# Altium project JacdacModuleTesterEc30 91.PrjPCB
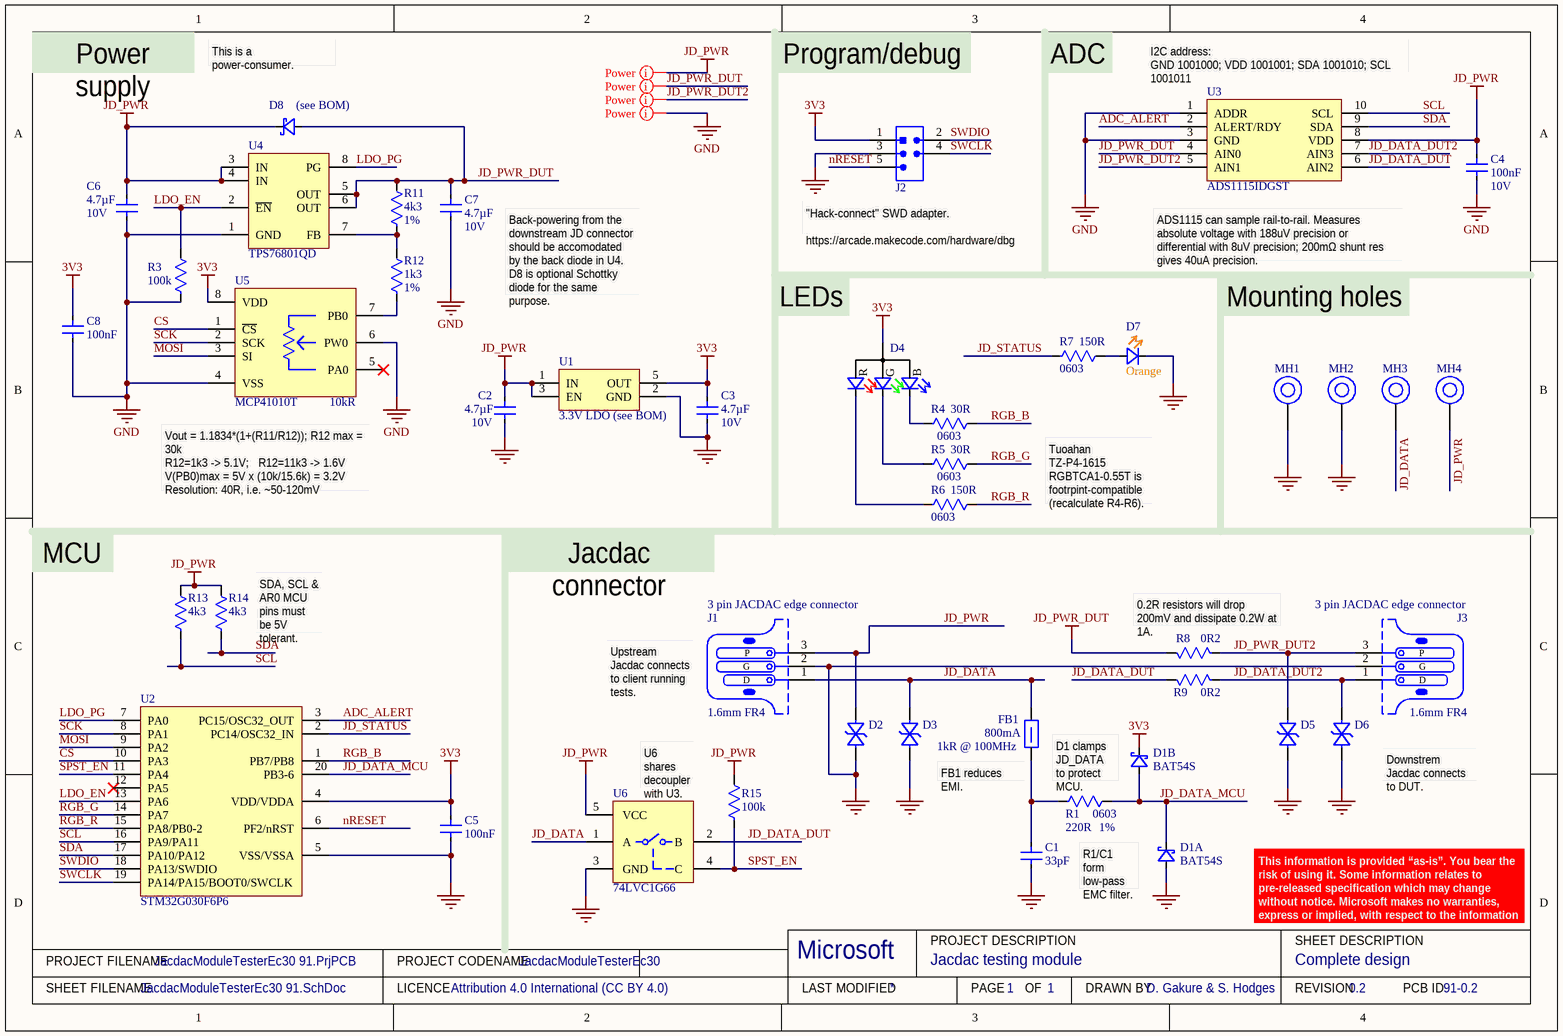
[diagram p0: JacdacModuleTesterEc30 91.SchDoc]
ProjectRevision: 0.2; ProjectLicenceTerms: Attribution 4.0 International (CC BY 4.0); ProjectDrawnBy: D. Gakure & S. Hodges; ProjectCodenameID: 91; ProjectCodenameDescription: Jacdac testing module; ProjectCodeName: JacdacModuleTesterEc30
1 sheet, 43 parts. Net scope: global (net labels, ports and power ports of the same name join across sheets).
Board file: JacdacModuleTesterEc30 91.PcbDoc

## Sheet JacdacModuleTesterEc30 91.SchDoc: Complete design
size A4; DrawnBy: D. Gakure & S. Hodges; DocumentNumber: 1; Revision: 0.2; SheetNumber: 1; SheetTotal: 1; VersionControl_RevNumber: 1

### Parts
C1  33pF  [CAP0603]
C2  Capacitance: 4.7µF  Voltage Rating: 10V  [CAP 0603 (1608) x 1.2mm]  (hidden comment: CL10A475KP8NNNC)
C3  Capacitance: 4.7µF  Voltage Rating: 10V  [CAP 0603 (1608) x 1.2mm]  (hidden comment: CL10A475KP8NNNC)
C4  Rated Voltage: 10V  [CAP0603]  (hidden comment: 100nF)
C5  100nF  [CAP0603]
C6  Capacitance: 4.7µF  Voltage Rating: 10V  [CAP 0603 (1608) x 1.2mm]  (hidden comment: CL10A475KP8NNNC)
C7  Capacitance: 4.7µF  Voltage Rating: 10V  [CAP 0603 (1608) x 1.2mm]  (hidden comment: CL10A475KP8NNNC)
C8  100nF  [CAP0603]
D1  BAT54S  [NXP-BAT54S-TO-236AB - without outline]  (parts A,B of 2)
D2  RCLAMP0521P-N  [TVS 0402 - L]  (value not drawn)
D3  RCLAMP0521P-N  [TVS 0402 - L]  (value not drawn)
D4  HSMF-C114  [HSMF-C114]  (value not drawn)
D5  RCLAMP0521P-N  [TVS 0402 - L]  (value not drawn)
D6  RCLAMP0521P-N  [TVS 0402 - L]  (value not drawn)
D7  Colour: Orange  [0603 Orange]  (hidden comment: 19-217/S2C-AQ1R1B/3T)
D8  Generic Part Number: (see BOM)  [MBR120VLSFT3G]  (hidden comment: MBR120VLSFT3G)
FB1  Current Rating: 800mA  Impedance: 1kR @ 100MHz  [TDK MPZ1608 0.8mm - without outline]  (hidden comment: TDK MPZ1608S102ATA00)
J1  3 pin JACDAC edge connector  PCB Type: 1.6mm FR4  [JACDAC_EDGE_CONNECTOR_NO_TRACES_CABLE_GUIDE]  (no BOM)
J2  Hack Connect Mini 1.27 mm pitch 2-row  [HACK_CONNECT_MINI_5_X_1_27]  (value not drawn)  (no BOM)
J3  3 pin JACDAC edge connector  PCB Type: 1.6mm FR4  [JACDAC_EDGE_CONNECTOR_NO_TRACES_CABLE_GUIDE]  (no BOM)
MH1  MH_7.0MMK_4.4MMC_3.1MMD_PTH  [MH_7.0MMK_4.4MMC_3.1MMD_PTH]  (value not drawn)  (no BOM)
MH2  MH_7.0MMK_4.4MMC_3.1MMD_PTH  [MH_7.0MMK_4.4MMC_3.1MMD_PTH]  (value not drawn)  (no BOM)
MH3  MH_7.0MMK_4.4MMC_3.1MMD_PTH  [MH_7.0MMK_4.4MMC_3.1MMD_PTH]  (value not drawn)  (no BOM)
MH4  MH_7.0MMK_4.4MMC_3.1MMD_PTH  [MH_7.0MMK_4.4MMC_3.1MMD_PTH]  (value not drawn)  (no BOM)
R1  Resistance Tolerance: 1%  Case/Package: 0603  [RC0603]  (hidden comment: 220R)
R3  100k  [RES0603]
R4  Case/Package: 0603  [RC0603]  (hidden comment: 30R)
R5  Case/Package: 0603  [RC0603]  (hidden comment: 30R)
R6  Case/Package: 0603  [RC0603]  (hidden comment: 150R)
R7  Case/Package: 0603  [RC0603]  (hidden comment: 150R)
R8  value 0R2  [RES1206]  (hidden comment: KDV12FR200ET)
R9  value 0R2  [RES1206]  (hidden comment: KDV12FR200ET)
R11  Tolerance: 1%  [RES0603]  (hidden comment: 4k3)
R12  Tolerance: 1%  [RES0603]  (hidden comment: 1k3)
R13  4k3  [RES0603]
R14  4k3  [RES0603]
R15  100k  [RES0603]
U1  Manufacturer Part Number 1: 3.3V LDO (see BOM)  [MICRONE-SOT23-5]
U2  STM32G030F6P6  [20-TSSOP]
U3  ADS1115IDGST  [ADS1115IDGST]
U4  TPS76801QD  [SOIC8]
U5  MCP41010T  Resistance: 10kR  [MICROCHIP-SOIC8]
U6  74LVC1G66  [TI-SOT23-5]

### Nets
3V3: C3.2 C5.2 C8.2 D1.2(K) D4.1(A) J2.1(VCC) U1.5(OUT) U2.4(VDD/VDDA) U5.8(VDD)
GND: C1.1 C2.1 C3.1 C4.1 C5.1 C6.1 C7.1 C8.1 D1.1(A) D2.2(A) D3.2(A) D5.2(A) D6.2(A) D7.1(K) J1.2(G) J2.3(GND) J3.2(G) MH1.1 MH2.1 R3.2 U1.2(GND) U2.5(VSS/VSSA) U3.1(ADDR) U3.3(GND) U4.1(GND) U5.4(VSS) U5.6(PW0) U6.3(GND)
JD_PWR: C2.2 C4.2 C6.2 D2.1(K) D8.1(K) J1.3(P) MH4.1 R13.1 R14.1 R15.1 U1.1(IN) U1.3(EN) U3.8(VDD) U4.3(IN) U4.4(IN) U6.5(VCC)
JD_PWR_DUT: C7.2 D8.2(A) R8.1 R11.1 U3.4(AIN0) U4.5(OUT) U4.6(OUT)
ADC_ALERT: U2.3(PC15/OSC32_OUT) U3.2(ALERT/RDY)
CS: U2.10(PA3) U5.1(~{CS})
JD_DATA: D3.1(K) FB1.1 J1.1(D) MH3.1 U6.1(A)
JD_DATA_DUT: R9.1 U3.6(AIN2) U6.2(B)
JD_DATA_DUT2: D6.1(K) J3.1(D) R9.2 U3.7(AIN3)
JD_DATA_MCU: D1.3(K) R1.2 U2.20(PB3-6)
JD_PWR_DUT2: D5.1(K) J3.3(P) R8.2 U3.5(AIN1)
JD_STATUS: R7.1 U2.2(PC14/OSC32_IN)
LDO_EN: R3.1 U2.13(PA6) U4.2(~{EN})
LDO_PG: U2.7(PA0) U4.8(PG)
MOSI: U2.9(PA2) U5.3(SI)
nRESET: J2.5(RESET) U2.6(PF2/nRST)
RGB_B: R4.2 U2.1(PB7/PB8)
RGB_G: R5.2 U2.14(PA7)
RGB_R: R6.2 U2.15(PA8/PB0-2)
SCK: U2.8(PA1) U5.2(SCK)
SCL: R13.2 U2.16(PA9/PA11) U3.10(SCL)
SDA: R14.2 U2.17(PA10/PA12) U3.9(SDA)
SPST_EN: R15.2 U2.11(PA4) U6.4(C)
SWCLK: J2.4(SWCLK) U2.19(PA14/PA15/BOOT0/SWCLK)
SWDIO: J2.2(SWDIO) U2.18(PA13/SWDIO)
NetC1_2: C1.2 FB1.2 R1.1
NetD4_2: D4.2(R) R6.1
NetD4_3: D4.3(G) R5.1
NetD4_4: D4.4(B) R4.1
NetD7_2: D7.2(A) R7.2
NetR11_2: R11.2 R12.1 U4.7(FB)
NetR12_2: R12.2 U5.7(PB0)

Not connected (* = marked no-connect by the designer): U2 12(PA5)*; U5 5(PA0)*

### Layout directives
net class Power: GND, JD_PWR, JD_PWR_DUT, JD_PWR_DUT2

### Notes on the sheet
- Power supply
- This is a power-consumer.
- Program/debug
- ADC
- (near U3) I2C address:
  GND 1001000; VDD 1001001; SDA 1001010; SCL 1001011
- (near J2) "Hack-connect" SWD adapter.
  https://arcade.makecode.com/hardware/dbg
- Back-powering from the downstream JD connector should be accomodated by the back diode in U4. D8 is optional Schottky diode for the same purpose.
- (near D4) LEDs
- (near U3) ADS1115 can sample rail-to-rail. Measures absolute voltage with 188uV precision or differential with 8uV precision; 200mΩ shunt res gives 40uA precision.
- Mounting holes
- (near U5) Vout = 1.1834*(1+(R11/R12)); R12 max = 30k
  R12=1k3 -> 5.1V;   R12=11k3 -> 1.6V
  V(PB0)max = 5V x (10k/15.6k) = 3.2V
  Resolution: 40R, i.e. ~50-120mV
- Tuoahan TZ-P4-1615
  RGBTCA1-0.55T is footrpint-compatible (recalculate R4-R6).
- MCU
- Jacdac connector
- (near R14) SDA, SCL & AR0 MCU pins must be 5V tolerant.
- (near R8) 0.2R resistors will drop 200mV and dissipate 0.2W at 1A.
- Upstream Jacdac connects to client running tests.
- U6 shares decoupler with U3.
- (near FB1) FB1 reduces EMI.
- D1 clamps JD_DATA to protect MCU.
- (near D6) Downstrem Jacdac connects to DUT.
- R1/C1 form low-pass EMC filter.
- This information is provided “as-is”. You bear the risk of using it. Some information relates to pre-released specification which may change without notice. Microsoft makes no warranties, express or implied, with respect to the information provided here.
- PROJECT FILENAME
- PROJECT CODENAME
- Microsoft
- PROJECT DESCRIPTION
- SHEET DESCRIPTION
- SHEET FILENAME
- LICENCE
- LAST MODIFIED
- PAGE
- OF
- DRAWN BY
- REVISION
- PCB ID

### Library data of the parts
C1 = CAP0603_GENERIC: Generic 0603 capacitor 33pF; Rated Voltage: 10V; Package Size: 0603; Value: 33pF; Manufacturer: Generic; Manufacturer 1: Generic
C2 C3 C6 C7 = 4.7uF 10V X5R ±10% Samsung CL: Generic 0603 capacitor 4.7uF 10V, e.g. Samsung CL10A475KP8NNNC; Dielectric: X5R; Tolerance: 10%; Created By: shodges; Supplier 1: Digi-Key; Manufacturer: Samsung; Manufacturer Part Number: CL10A475KP8NNNC; Stock 1: 40000; Pricing 1: 1=0.15, 10=0.109, 100=0.0513, 500=0.036, 1000=0.0298 (USD); Mount: Surface Mount; Case Code (Imperial): 0603; Contact Plating: Tin; Min Operating Temperature: -55°C; Max Operating Temperature: 85°C; Package Quantity: 1; Packaging: Tape and Reel; Length: 1.6mm; Height: 0.8mm; Width: 0.031inch; Thickness: 0.035inch; Depth: 0.8mm; Radiation Hardening: No; Supplier Part Number 1: 1276-1044-1-ND; Supplier 2: Farnell; Supplier Part Number 2: 3010071; Case Code (Metric): 1608; Case/Package: 0603
C4 = CAP0603_GENERIC: Generic 0603 capacitor 100nF; Package Size: 0603; Value: 100nF; Manufacturer: Generic; Manufacturer 1: Generic
C5 C8 = CAP0603_GENERIC: Generic 0603 capacitor 100nF; Rated Voltage: 10V; Package Size: 0603; Value: 100nF; Manufacturer: Generic; Manufacturer 1: Generic
D1 = BAT54S: DIODE ARRAY SCHOTTKY 30V SOT23; Manufacturer: Nexperia; Manufacturer Part Number: BAT54S,235; Supplier 1: Digi-Key; RoHS: No; Category: Rectifier Diodes; Stock 1: 14011; Pricing 1: 1=0.13000, 10=0.11900, 100=0.05610, 500=0.03326, 1000=0.02185, 5000=0.02138 (USD); ComponentLink1URL: https://assets.nexperia.com/documents/data-sheet/BAT54_SER.pdf; ComponentLink1Description: NXP datasheet online; Supplier 2: Mouser; Supplier 3: RSComponents; Supplier Part Number 2: 771-BAT54S235; Supplier Part Number 3: 1707990; Supplier Part Number 1: 1727-1868-1-ND; Generic Part Number: BAT54S
D2 D3 D5 D6 = RCLAMP0521P-N: Bidirectional 5V (Max) 6V 16V 3.5A (8/20us) 0402 TVS RoHS; Manufacturer: Born Semiconductor; Package: 0402; Created By: D Gakure; Checked By: ?; Supplier1: LCSC; Supplier1 Part Number: C316043; ComponentLink1Description: Online datasheet; ComponentLink1URL: https://datasheet.lcsc.com/szlcsc/Bourne-Semicon-Shenzhen-RCLAMP0521P-N_C316043.pdf; Manufacturer Part Number: RCLAMP0521P-N
D4 = HSMF-C114: RGB LED 0606 (1616 Metric); 626nm R, 525nm G, 470nm B; 1.9V R, 3.4V G, 3.4V B; Manufacturer: Broadcom Avago; Color: Blue,Green,Red; Lens Color: White; Viewing Angle: 145°; Luminous Intensity: 70mcd; Lens Style: Diffused,Rectangular; Forward Current: 20mA; Lens Transparency: Diffused; Number of Elements: 3; Reverse Voltage: 5V; Power Rating: 78mW; Supplier 1: Digi-Key; Manufacturer Part Number: HSMF-C114; RoHS: Yes; Category: Optoelectronics; Stock 1: 20555; Pricing 1: 1=1.78000, 10=1.12500, 100=0.83250, 500=0.76500, 1000=0.63000, 2000=0.59850 (USD); Mount: Surface Mount; Case/Package: 0606; Number of Pins: 4; Case Code (Metric): 1616; Case Code (Imperial): 0606; Min Operating Temperature: -40°C; Max Operating Temperature: 85°C; Forward Voltage: 3.4V; Packaging: Tape and Reel; Wavelength: 470nm; Package Quantity: 4000; Dominant Wavelength: 470nm; Test Current: 20mA; Number of LEDs: 3; Length: 1.6mm; Width: 1.5mm; Height: 0.35mm; Depth: 1.6mm; Radiation Hardening: No; REACH SVHC: No SVHC; Lead Free: Lead Free; Supplier 2: Farnell; Stock 2: 8134; Pricing 2: 1=1.56000, 10=0.97100, 25=0.87800, 50=0.78500, 100=0.69200, 500=0.60500 (GBP); Supplier 3: Mouser; Stock 3: 14991; Pricing 3: 1=1.69000, 10=1.13000, 50=1.13000, 100=0.85600, 1000=0.74800, 10000=0.74800 (USD); Supplier Part Number 1: 516-1795-1-ND; Supplier Part Number 3: 630-HSMF-C114; Supplier Part Number 2: 1058362; ComponentLink1Description: Online datasheet; ComponentLink1URL: https://docs.broadcom.com/docs/AV02-2451EN; Created By: D. Gakure; Checked By: ?; Supplier Part Number 10: ?
D7 = 19-217/S2C-AQ1R1B/3T: LED ORANGE DIFFUSED 0603 SMD; Manufacturer: Everlight Elec; Manufacturer Part Number: 19-217/S2C-AQ1R1B/3T; Mount: Surface Mount; Case/Package: 0603; Color: Orange; Case Code (Imperial): 0603; ComponentLink1URL: https://datasheet.lcsc.com/lcsc/1912171731_Everlight-Elec-19-217-S2C-AQ1R1B-3T_C146215.pdf; ComponentLink1Description: Online datasheet; Supplier 1: LCSC; Supplier 1 Part Number: C146215
D8 = MBR120VLSFT3G: DIODE SCHOTTKY 20V 1A SOD123FL; Manufacturer: ON Semiconductor; Max Surge Current: 45A; Forward Voltage: 340mV; Peak Reverse Current: 600uA; Element Configuration: Single; Polarity: Standard; Supplier 1: Digi-Key; RoHS: Yes; Category: Schottky Diodes; Stock 1: 32481; Pricing 1: 1=0.39000, 10=0.28600, 100=0.19920, 500=0.12616, 1000=0.10292, 2000=0.09960, 5000=0.09628 (USD); Number of Pins: 2; Min Operating Temperature: -65°C; Max Operating Temperature: 125°C; Package Quantity: 10000; Forward Current: 1A; Packaging: Tape and Reel; Max Reverse Leakage Current: 600uA; Average Rectified Current: 1A; Peak Non-Repetitive Surge Current: 45A; Max Repetitive Reverse Voltage (Vrrm): 20V; Max Forward Surge Current (Ifsm): 45A; Voltage Rating (DC): 20V; Current Rating: 1A; Output Current: 1A; Max Reverse Voltage (DC): 20V; Radiation Hardening: No; REACH SVHC: No SVHC; Lead Free: Lead Free; Halogen Free: Halogen Free; ComponentLink4URL: https://datasheet.ciiva.com/6380/mbr120vlsft1-d-6380910.pdf; ComponentLink4Description: On Semi datasheet online; Supplier 2: Mouser; Supplier 3: RSComponents; Supplier Part Number 3: 1867479; Supplier Part Number 2: 863-MBR120VLSFT3G; Supplier Part Number 1: MBR120VLSFT3GOSCT-ND; Manufacturer Part Number: MBR120VLSFT3G
FB1 = TDK MPZ1608S102ATA00: 0603 1k@100MHz 0.8A chip; Core Material: Ferrite; Tolerance: 25%; DC Resistance (DCR): 300mR; Supplier 1: Digi-Key; Stock 1: 113542; Pricing 1: 1=0.1, 10=0.079, 25=0.0716, 50=0.0644, 100=0.0472, 250=0.03432, 500=0.03146, 1000=0.02717 (USD); Mount: Surface Mount; Case/Package: 0603; Case Code (Metric): 1608; Case Code (Imperial): 0603; Package Quantity: 4000; Packaging: Tape and Reel; Max DC Current: 800mA; Length: 0.063inch; Height: 0.037inch; Width: 0.031inch; ComponentLink2URL: https://www.mouser.co.uk/datasheet/2/400/eads_commercial_power_mpz1608_en-923650.pdf; ComponentLink2Description: datasheet online; Supplier 2: Mouser; ComponentLink3Description: datasheet; ComponentLink3URL: Y:\System\Altium\Libraries 2014\TDK\Datasheets\eads_commercial_power_mpz1608_en-923650.pdf; Supplier Part Number 1: 445-8694-1-ND; Supplier Part Number 2: 810-MPZ1608S102ATA00; Manufacturer: TDK; Manufacturer Part Number: MPZ1608S102ATA00
J1 J3 = Jacdac edge connector: 3 pin Jacdac edge connector 1.27mm pitch; Manufacturer Part Number: JACDAC_EDGE_CONNECTOR; Checked By: ?; Created By: D. Gakure; ComponentLink1Description: Yuliang JACDAC cable connector drawing online; ComponentLink1URL: https://github.com/microsoft/jacdac-mdk/blob/main/connector/JACDAC-Connector-by-Yuliang-2020-11-28.pdf; ComponentLink2Description: JACDAC PCB edge connector spec onlin; ComponentLink2URL: https://github.com/microsoft/jacdac-mdk/blob/main/connector/JACDAC_PCB_Edge_Connector_Drawing_JD-PEC-01_rev_01.pdf
J2 = HACK_CONNECT_MINI
MH1-MH4 = MH_7.0MMK_4.4MMC_3.1MMD_PTH: Mounting Hole 7.0mm keepout, 4.4mm annualar ring and 3.1mm Drill PTH
R1 = RC0603FR-07220RL: Res Thick Film 0603 220 Ohm 1% 0.1W ±100ppm/°C SMD; Manufacturer 1: Yageo; Max Power Dissipation: 100mW; Voltage Rating: 50V; ComponentLink1URL: https://datasheet.ciiva.com/11819/0900766b80f96399-11819290.pdf; ComponentLink1Description: Online datasheet; Supplier 1: Digi-Key; Manufacturer Part Number 1: RC0603FR-07220RL; RoHS: Yes; Category: Chip SMD Resistors; Stock 1: 242327; Pricing 1: 1=0.10000, 10=0.02400, 100=0.00970, 1000=0.00436, 2500=0.00378 (USD); Number of Pins: 2; Case Code (Imperial): 0603; Case Code (Metric): 1608; Size Code: 0603; Min Operating Temperature: -55°C; Max Operating Temperature: 155°C; Packaging: Tape and Reel; Tolerance: 1%; Resistor Type: Thick Film; Number of Terminations: 2; Temperature Coefficient: 100ppm/°C; Series: RC; Power Rating: 100mW; Package Quantity: 1; Features: Moisture Resistant; Voltage Rating (DC): 50V; Termination: SMD/SMT; Construction: Rectangular; Length: 1.6mm; Width: 0.031inch; Height: 0.022inch; Depth: 0.8mm; RoHS Compliant: Yes; REACH SVHC: No SVHC; Military Standard: Not; Lead Free: Lead Free; Supplier 2: Farnell; Supplier 3: RSComponents; Supplier 4: Mouser; Supplier Part Number 1: 311-220HRCT-ND; Supplier Part Number 3: 1995497; Supplier Part Number 2: 9238409; Supplier Part Number 4: 603-RC0603FR-07220RL; Supplier 5: LCSC; Supplier Part Number 5: C107696; Resistance: 220R; Manufacturer: Yageo; Manufacturer Part Number: RC0603FR-07220RL
R3 R15 = RES0603_GENERIC: Generic 0603 chip resistor 100k; Power: *mW; Tolerance: 5%; Value: 100k; Manufacturer: Generic; Package Size: 0603; Manufacturer 1: Generic
R4 R5 = RC0603FR-0730RL: Res Thick Film 0603 30 Ohm 1% 0.1W ±100ppm/°C SMD; Manufacturer 1: Yageo; Voltage Rating (DC): 50V; Power Rating: 100mW; ComponentLink1URL: https://datasheet.ciiva.com/11819/0900766b80f96399-11819290.pdf; ComponentLink1Description: Online datasheet; Supplier 1: Digi-Key; Manufacturer Part Number 1: RC0603FR-0730RL; RoHS: Yes; Category: Chip SMD Resistors; Stock 1: 181493; Pricing 1: 1=0.10000, 10=0.02400, 100=0.00970, 1000=0.00436, 2500=0.00378 (USD); Mount: Surface Mount; Case Code (Imperial): 0603; Size Code: 0603; Min Operating Temperature: -55°C; Max Operating Temperature: 155°C; Resistor Type: Thick Film; Temperature Coefficient: 100ppm/°C; Packaging: Tape and Reel; Package Quantity: 1; Voltage Rating: 50V; Number of Terminations: 2; Termination: SMD/SMT; Max Power Dissipation: 100mW; Features: Moisture Resistant; Series: RC; Construction: Rectangular; Technology: THICK FILM; Length: 0.063inch; Width: 0.031inch; Height: 0.022inch; Depth: 0.8mm; Lead Free: Lead Free; Military Standard: Not; RoHS Compliant: Yes; Supplier 2: Farnell; Supplier 3: Mouser; Case Code (Metric): 1608; Supplier Part Number 1: 311-30.0HRCT-ND; Supplier Part Number 2: 3495813; Supplier Part Number 3: 603-RC0603FR-0730RL; Supplier 5: LCSC; Supplier Part Number 5: C128060; Tolerance: 1%; Resistance: 30R; Manufacturer: Yageo; Manufacturer Part Number: RC0603FR-0730RL
  R4: ComponentLink2URL: https://datasheet.ciiva.com/11819/0900766b80c66297-11819676.pdf?src-supplier=RSComponents; ComponentLink2Description: https://datasheet.ciiva.com/11819/0900766b80c66297-11819676.pdf?src-supplier=RSComponents; ComponentLink3URL: https://datasheet.ciiva.com/2455/pyu-r-int-thick-7-2455119.pdf?src-supplier=Digi-Key; ComponentLink3Description: https://datasheet.ciiva.com/2455/pyu-r-int-thick-7-2455119.pdf?src-supplier=Digi-Key; ComponentLink4URL: https://datasheet.ciiva.com/2455/pyu-r-int-thick-7-2455120.pdf?src-supplier=Digi-Key; ComponentLink4Description: https://datasheet.ciiva.com/2455/pyu-r-int-thick-7-2455120.pdf?src-supplier=Digi-Key; ComponentLink5URL: https://datasheet.ciiva.com/2455/pyu-r-int-thick-7-2455121.pdf?src-supplier=Digi-Key; ComponentLink5Description: https://datasheet.ciiva.com/2455/pyu-r-int-thick-7-2455121.pdf?src-supplier=Digi-Key
R6 R7 = RC0603FR-07150RL: Res Thick Film 0603 150 Ohm 1% 1/10W ±100ppm/°C SMD; Manufacturer 1: Yageo; Power Rating: 100mW; Voltage Rating (DC): 50V; ComponentLink1URL: https://datasheet.ciiva.com/11819/0900766b80f96399-11819290.pdf; ComponentLink1Description: Online datasheet; Supplier 1: Digi-Key; Manufacturer Part Number 1: RC0603FR-07150RL; RoHS: Yes; Category: Chip SMD Resistors; Stock 1: 2262542; Pricing 1: 1=0.10000, 10=0.02400, 100=0.00970, 1000=0.00436, 2500=0.00378 (USD); Number of Pins: 2; Case Code (Imperial): 0603; Case Code (Metric): 1608; Size Code: 0603; Min Operating Temperature: -55°C; Max Operating Temperature: 155°C; Tolerance: 1%; Packaging: Tape and Reel; Temperature Coefficient: 100ppm/°C; Voltage Rating: 50V; Package Quantity: 5000; Termination: SMD/SMT; Resistor Type: Thick Film; Features: Moisture Resistant; Series: RC; Max Power Dissipation: 100mW; Number of Terminations: 2; Construction: Rectangular; Length: 1.6mm; Width: 0.8mm; Height: 0.45mm; Depth: 0.8mm; REACH SVHC: No SVHC; Lead Free: Lead Free; Military Standard: Not; RoHS Compliant: Yes; Supplier 2: Farnell; Supplier 3: RSComponents; Supplier 4: Mouser; Supplier Part Number 1: 311-150HRCT-ND; Supplier Part Number 2: 9238387; Supplier Part Number 3: 1995464; Supplier Part Number 4: 603-RC0603FR-07150RL; Supplier 5: LCSC; Supplier Part Number 5: C114608; Resistance Tolerance: 1%; Resistance: 150R
  R6: Manufacturer: Yageo; Manufacturer Part Number: RC0603FR-07150RL
R8 R9 = KDV12FR200ET: Res 200mOhm 1% 1/2W 1206; Manufacturer 1: Ohmite; Power: 500mW; ComponentLink1Description: Ohmite datasheet online; ComponentLink1URL: https://www.ohmite.com/assets/docs/res_kdv.pdf; Supplier 1: Digi-Key; Manufacturer Part Number 1: KDV12FR200ET; RoHS: Yes; Category: Chip SMD Resistors; Stock 1: 23605; Pricing 1: 1=0.31000, 10=0.26400, 25=0.19200, 50=0.13920, 100=0.10320, 250=0.07920, 500=0.06240, 1000=0.04320 (USD); Supplier 2: Farnell; Supplier 3: Mouser; Supplier Part Number 1: 273-KDV12FR200ETCT-ND; Supplier Part Number 2: 3273737; Supplier Part Number 3: 588-KDV12FR200ET; Tolerance: 1%; Package Size: 1206; Manufacturer: Ohmite; Manufacturer Part Number: KDV12FR200ET
R11 = RES0603_GENERIC: Generic 0603 chip resistor 4k3; Power: *mW; Value: 4k3; Manufacturer: Generic; Package Size: 0603; Manufacturer 1: Generic
R12 = RES0603_GENERIC: Generic 0603 chip resistor 1k3; Power: *mW; Value: 1k3; Manufacturer: Generic; Package Size: 0603; Manufacturer 1: Generic
R13 R14 = RES0603_GENERIC: Generic 0603 chip resistor 4k3; Power: *mW; Tolerance: 1%; Value: 4k3; Manufacturer: Generic; Package Size: 0603; Manufacturer 1: Generic
U1 = ME6211C33M5G-N: 3.3V LDO. Vin 6V max, Vf 260mV @ 200mA (typ); Manufacturer 1: MICRONE(Nanjing Micro One Elec); Output Current: 500mA; Output Type: Fixed; Output Configuration: Positive; Number of Regulators: 1; Max Input Voltage: 6; Dropout Voltage: 200mV; Supplier Part Number: C82942; Category: Voltage Regulators - Linear; Stock 1: 32529; Pricing 1: 1=0.33000, 10=0.24900, 25=0.21760, 100=0.12440, 250=0.11664, 500=0.09330, 1000=0.07153 (USD); Mount: Surface Mount; Case/Package: SOT-23-5; Supplier 1: LCSC; Min Output Voltage: 3.3V; ComponentLink3URL: https://datasheet.lcsc.com/lcsc/1811131510_MICRONE-Nanjing-Micro-One-Elec-ME6211C33M5G-N_C82942.pdf; ComponentLink3Description: On Semi datasheet online; Created: DG; Checked: ?; Manufacturer: MICRONE(Nanjing Micro One Elec); Manufacturer Part Number: 3.3V LDO (see BOM)
U2 = STM32G030F6P6: ARM® Cortex®-M0+ series IC 64MHz 32KB 20-TSSOP; Manufacturer 1: STMicroelectronics; ComponentLink1Description: Online datasheet; ComponentLink1URL: https://www.st.com/resource/en/datasheet/stm32g030f6.pdf; ComponentLink2Description: Online reference manual; ComponentLink2URL: https://www.st.com/resource/en/reference_manual/rm0454-stm32g0x0-advanced-armbased-32bit-mcus-stmicroelectronics.pdf; Supplier 1: Digi-Key; Manufacturer Part Number 1: STM32G030F6P6; RoHS: Yes; Category: Microcontrollers; Pricing 1: 1=1.85000, 10=1.65300, 74=1.56905, 148=1.28892, 296=1.20486, 444=1.06475, 962=0.93400 (USD); RoHS Compliant: Yes; Supplier 2: Farnell; Supplier 3: Mouser; Supplier 10: LCSC; Supplier Part Number 1: 497-STM32G030F6P6-ND; Supplier Part Number 2: 3294301; Supplier Part Number 3: 511-STM32G030F6P6; Supplier Part Number 10: C724040; Manufacturer: STMicroelectronics; Manufacturer Part Number: STM32G030F6P6
U3 = ADS1115IDGST: IC ADC 16-BIT I2C PROGBL 10-MSOP; Manufacturer: Texas Instruments (TI); Resolution: 16 Bit; Sampling Rate: 860 sps; Number of ADCs: 1; Number of Analog Inputs: 4|2; Architecture: Delta-Sigma; Digital Interface Type: Serial (2-Wire, I2C); Input Type: Voltage; Polarity of Input Voltage: Bipolar; Maximum Single Supply Voltage: 5.5 V; Typical Single Supply Voltage: 3.3 V; Voltage Supply Source: Single; Sample and Hold: No; Minimum Single Supply Voltage: 2 V; Typical Power Dissipation: 0.9 mW; Input Voltage: 4.096 V; Input Signal Type: Single-Ended|Differential; Integral Nonlinearity Error: 1 LSB; Single-Ended Input: Yes; Full Scale Error: 0.15 % of FSR; Lead Finish: Gold; Max Processing Temp: 260; Voltage Reference: Internal; Supplier 1: Digikey; Manufacturer Part Number: ADS1115IDGST; Stock 1: 6232; Pricing 1: 1=6.51, 10=5.847, 100=4.7903 (USD); Package: 10VSSOP; Category: ADC; Operating Temperature: -40 to 125 C; Mounting: Surface Mount; Digital Supply Support: No; Differential Input: Yes; Supplier Part Number 1: 296-24934-1-ND; ComponentLink1Description: online datasheet; ComponentLink1URL: http://www.ti.com/lit/ds/symlink/ads1115.pdf
U4 = TPS76801QD: 1-A, 10-V, low-dropout voltage regulator with power good & enable 8-SOIC -40 to 125; Manufacturer 1: Texas Instruments; Number of Outputs: 1; Output Voltage: 5.5V; Output Current: 1A; Dropout Voltage: 230mV; Max Input Voltage: 10V; Min Input Voltage: 2.7V; Reference Voltage: 1.1834V; Min Output Voltage: 1.2V; Quiescent Current: 80uA; Polarity: Positive; Accuracy: 2%; Output Type: Adjustable,Fixed; Input Bias Current: 85uA; Max Power Dissipation: 904.15mW; Min Current Limit: 1.2A; ComponentLink1URL: https://datasheet.lcsc.com/lcsc/1810181640_Texas-Instruments-TPS76801QDR_C20030.pdf; ComponentLink1Description: TI datasheet online; Supplier 1: Digi-Key; RoHS: Yes; Category: Voltage Regulators - Linear; Pricing 1: 1=4.25000, 10=3.81700, 25=3.60840, 100=3.12740, 250=2.96700, 500=2.66228, 1000=2.64775 (USD); Case/Package: D; Number of Pins: 8; Min Operating Temperature: -40°C; Max Operating Temperature: 125°C; Packaging: Rail/Tube; Package Quantity: 75; Max Output Current: 1A; Number of Regulators: 1; Max Output Voltage: 5.5V; Power Dissipation: 904.15mW; Series: -; Power Rating: 904.15mW; Current Rating: 1A; Length: 4.9mm; Width: 3.91mm; Height: 1.58mm; Radiation Hardening: No; Lead Free: Lead Free; RoHS Compliant: Yes; REACH SVHC: No SVHC; Supplier 2: Farnell; Supplier 3: RSComponents; Supplier 4: Mouser; Supplier Part Number 4: 595-TPS76801QD; Supplier Part Number 3: 1624919; Supplier Part Number 2: 3122534; Supplier Part Number 1: 296-2743-5-ND; Manufacturer Part Number 1: TPS76801QD; Manufacturer: Texas Instruments; Manufacturer Part Number: TPS76801QD
U5 = MCP41010T: Digital Pot; 256 steps; SPI; 10kohms; single channel8 SOIC 3.90mm(.150in) T/R; Manufacturer 1: Microchip; Manufacturer Part Number 1: MCP41010T-I/SN; Interface: SPI,Serial; Max Supply Voltage: 5.5V; Min Supply Voltage: 2.7V; Nominal Supply Current: 340uA; Number of Circuits: 1; Number of Taps: 256; Memory Type: Volatile; Temperature Coefficient: 800ppm/°C; Tolerance: 20%; Frequency: 10MHz; Quiescent Current: 10nA; Voltage: 5V; ComponentLink1Description: Microchip datasheet online; ComponentLink1URL: https://ww1.microchip.com/downloads/en/DeviceDoc/11195c.pdf; Supplier 1: Digi-Key; RoHS: Yes; Category: Digital Potentiometers; Stock 1: 1862; Pricing 1: 1=1.74000, 25=1.59000 (USD); Mount: Surface Mount; Case/Package: SOIC; Number of Pins: 8; Min Operating Temperature: -40°C; Max Operating Temperature: 85°C; Packaging: Tape and Reel; Package Quantity: 3300; Resistor Type: Potentiometer; Number of Positions: 256; Number of Elements: 1; Taper: Linear; Number of Channels: 1; Series: -; Supply Current: 340uA; Radiation Hardening: No; Lead Free: Lead Free; RoHS Compliant: Yes; Supplier 2: Farnell; Supplier 3: Mouser; Supplier Part Number 2: 2857765; Supplier Part Number 3: 579-MCP41010T-I/SN; Supplier Part Number 1: MCP41010T-I/SNCT-ND; Manufacturer: Microchip; Manufacturer Part Number: MCP41010T-I/SN
U6 = SN74LVC1G66DBVR: 1 Circuit IC Switch 1:1 10 Ohm SOT-23-5; Manufacturer 1: Texas Instruments; Number of Channels: 1; On-State Resistance: 10R; Max Supply Voltage: 5.5V; Min Supply Voltage: 1.65V; Throw Configuration: SPST; Supply Type: Single; Nominal Supply Current: 1uA; Operating Supply Current: 10uA; Turn-On Delay Time: 4.2ns; Turn-Off Delay Time: 5ns; Propagation Delay: 600ps; Polarity: Non-Inverting; High Level Output Current: 50mA; Bandwidth: 195MHz; Supplier 1: Digi-Key; Manufacturer Part Number 1: SN74LVC1G66DBVR; RoHS: Yes; Category: Interface ICs; Pricing 1: 1=0.48000, 10=0.36200, 25=0.32640, 100=0.22560, 250=0.18996, 500=0.15434, 1000=0.11872 (USD); Mount: Surface Mount; Case/Package: SOT-23; Number of Pins: 5; Weight: 0.000395oz; Contact Plating: Gold; Min Operating Temperature: -40°C; Max Operating Temperature: 85°C; Packaging: Tape and Reel; Number of Inputs: 1; Number of Outputs: 1; Package Quantity: 3000; Series: 74LVC; Max Supply Current: 10uA; Number of Bits: 1; Supply Current: 1uA; Low Level Output Current: 50mA; Termination: SMD/SMT; Output Current: 50mA; Length: 3.05mm; Width: 1.75mm; Height: 1.3mm; Radiation Hardening: No; RoHS Compliant: Yes; Lead Free: Lead Free; REACH SVHC: No SVHC; Supplier 2: Farnell; Supplier 3: RSComponents; Supplier 4: Mouser; Supplier Part Number 1: 296-13253-1-ND; Supplier Part Number 2: 3118254; Supplier Part Number 3: 8096012; Supplier Part Number 4: 595-SN74LVC1G66DBVR; ComponentLink1Description: online datasheet; ComponentLink1URL: https://datasheet.lcsc.com/lcsc/1809251629_Texas-Instruments-SN74LVC1G66DBVR_C133643.pdf; Manufacturer: Texas Instruments; Manufacturer Part Number: SN74LVC1G66DBVR